# Altium project NTC_Extension_5Fach.PrjPcb
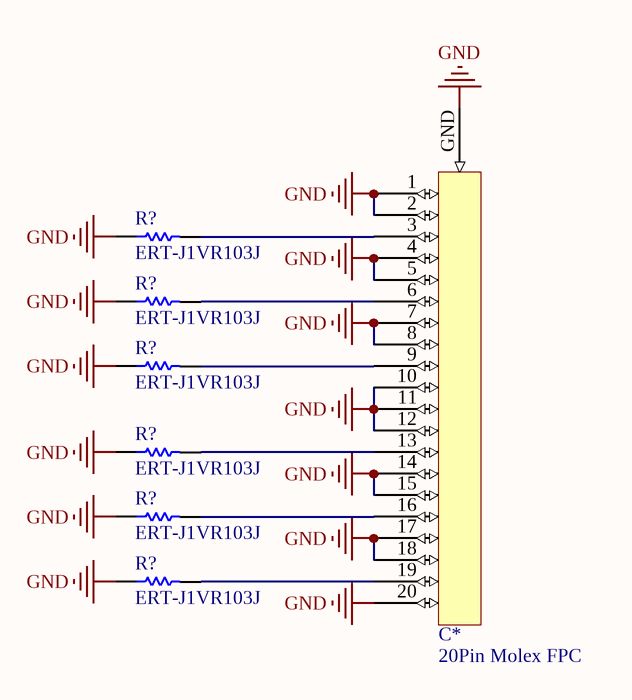
[diagram p0: Main_NTC_Extension_5fach.SchDoc]
1 sheet, 7 parts. Net scope: global (net labels, ports and power ports of the same name join across sheets).
Board file: NTC_Extension_5fach.PcbDoc

## Sheet Main_NTC_Extension_5fach.SchDoc
size A4; SheetNumber: 1; SheetTotal: 1

### Parts
C*  20Pin Molex FPC  [Molex 20 Pin FPC]
R1  ERT-J1VR103J  [RESC1608X90X30ML15T20]
R2  ERT-J1VR103J  [RESC1608X90X30ML15T20]
R3  ERT-J1VR103J  [RESC1608X90X30ML15T20]
R4  ERT-J1VR103J  [RESC1608X90X30ML15T20]
R5  ERT-J1VR103J  [RESC1608X90X30ML15T20]
R?  ERT-J1VR103J  [RESC1608X90X30ML15T20]

### Nets
GND: C*.1 C*.2 C*.4 C*.5 C*.7 C*.8 C*.10 C*.11 C*.12 C*.14 C*.15 C*.17 C*.18 C*.20 C*.GND R1.1 R2.1 R3.1 R4.1 R5.1 R?.1
NetC*_3: C*.3 R1.2
NetC*_6: C*.6 R2.2
NetC*_9: C*.9 R3.2
NetC*_13: C*.13 R5.2
NetC*_16: C*.16 R4.2
NetC*_19: C*.19 R?.2

### Library data of the parts
C* = 20Pin Molex FPC: Flex PCB part for the Molex 20pin FCC
R1-R5 R? = CMP-2000-00869-1: Manufacturer: Panasonic; Part Number: ERT-J1VR103J